# Altium project parero_DSP_board.PrjPcb
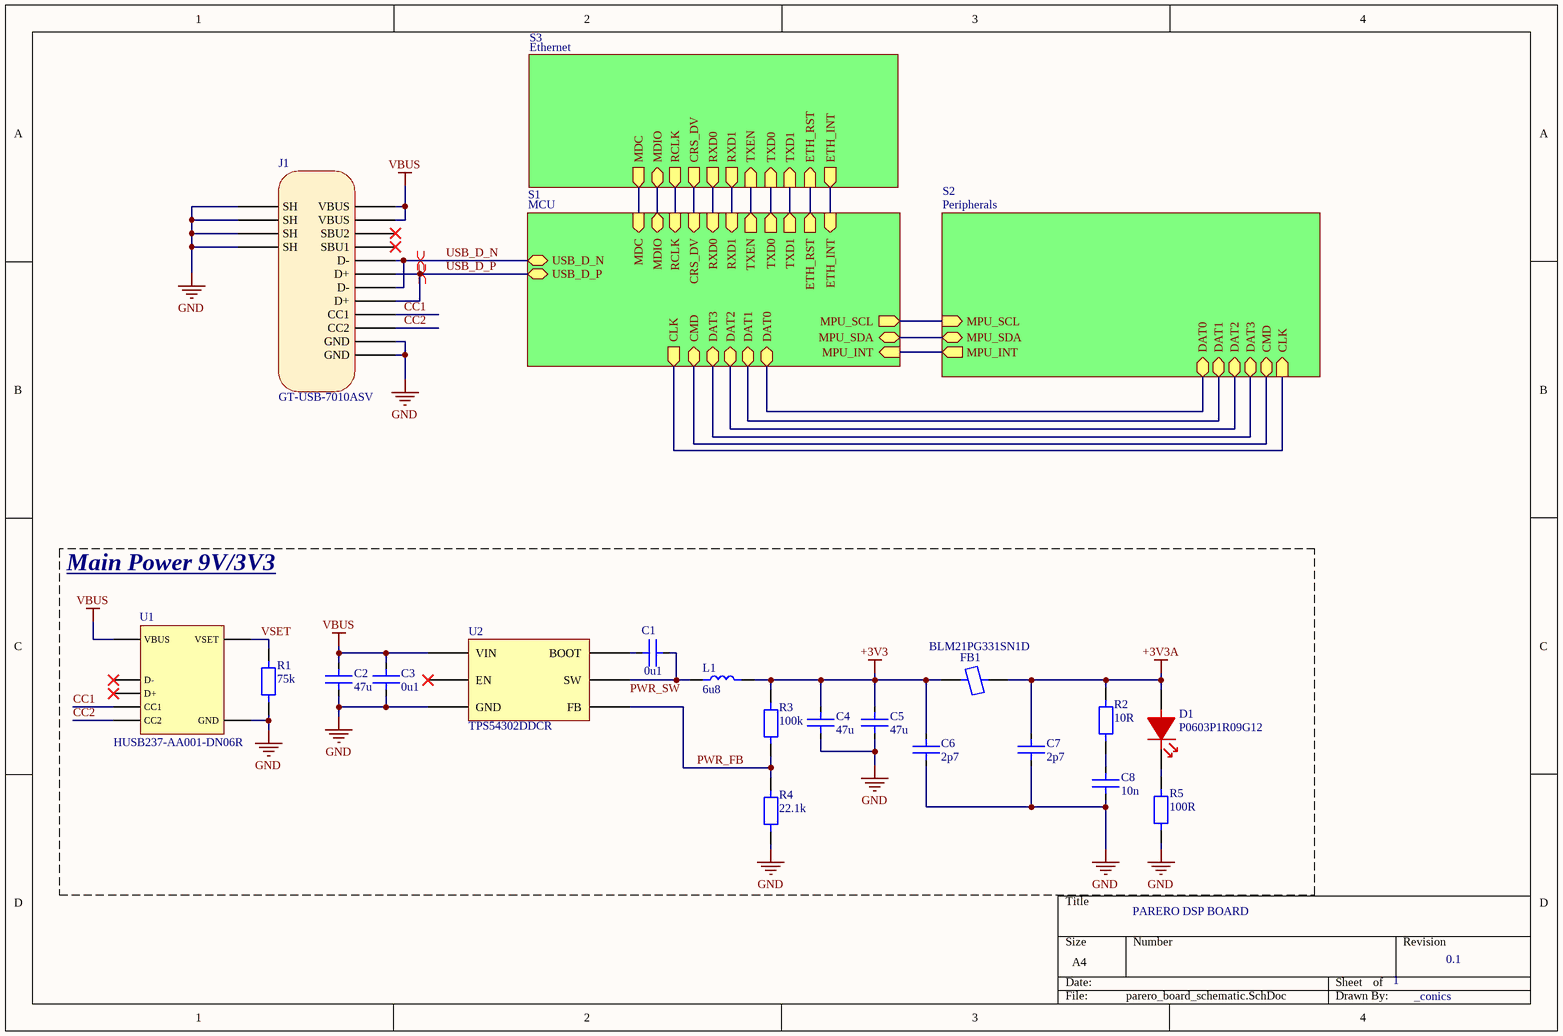
[diagram p0: parero_board_schematic.SchDoc]
4 sheets, 121 parts. Net scope: hierarchical (ports join the sheet entries above them; power ports are global).
Board file: parero_DSP_board.PcbDoc
Sheets:
  parero_board_schematic.SchDoc
    S1 = MCU.SchDoc
    S2 = Peripherals.SchDoc
    S3 = Ethernet.SchDoc

## Sheet parero_board_schematic.SchDoc: PARERO DSP BOARD
size A4; ApprovedBy: _conics; CheckedBy: Abdulrahman SJ; CompanyName: PARERO; DrawnBy: Abdulrahman; DocumentNumber: 1; Revision: 0.1; SheetNumber: 1; SheetTotal: 4

### Parts
C1  0u1  [CAP_MLCC_0402]
C2  47u  [CAP_MLCC_1210]
C3  0u1  [CAP_MLCC_0603]
C4  47u  [CAP_MLCC_1210]
C5  47u  [CAP_MLCC_1210]
C6  2p7  [CAP_MLCC_0402]
C7  2p7  [CAP_MLCC_0402]
C8  10n  [CAP_MLCC_0402]
D1  P0603P1R09G12  [LED_0603]
FB1  BLM21PG331SN1D  [FBEAD_0805]
J1  GT-USB-7010ASV  [CONN_CH_USB_SMD_USB]
L1  6u8  [INDM5452X30N]
R1  75k  [RES_SMD_0402]
R2  10R  [RES_SMD_0402]
R3  100k  [RES_SMD_0402]
R4  22.1k  [RES_SMD_0402]
R5  100R  [RES_SMD_0402]
U1  HUSB237-AA001-DN06R  [USB_PD_DFN6]
U2  TPS54302DDCR  [SOT95P280X110-6N]

### Blocks framed on the sheet
Main Power 9V/3V3: C1-C8 D1 FB1 L1 R1-R5 U1 U2

### Sub-sheets
S1 = MCU: MPU_SDA (bidir), MPU_INT (in), MPU_SCL (out), DAT0 (bidir), DAT1 (bidir), DAT2 (bidir), DAT3 (bidir), CMD (bidir), CLK (out), USB_D_P (bidir), USB_D_N (bidir), MDC (in), RCLK (in), MDIO (bidir), CRS_DV (in), RXD0 (in), RXD1 (in), TXD0 (out), TXEN (out), TXD1 (out), ETH_INT (in), ETH_RST (out)
S2 = Peripherals: MPU_SCL (in), MPU_SDA (bidir), MPU_INT (out), CLK (in), CMD (bidir), DAT3 (bidir), DAT2 (bidir), DAT1 (bidir), DAT0 (bidir)
S3 = Ethernet: RXD0 (out), RXD1 (out), TXD0 (in), TXD1 (in), RCLK (out), ETH_INT (out), CRS_DV (out), TXEN (in), MDC (out), MDIO (bidir), ETH_RST (in)

### Nets
+3V3: C4.2 C5.2 C6.2 FB1.2 L1.2 R3.2
+3V3A: C7.2 D1.2 FB1.1 R2.2
GND: C2.1 C3.1 C4.1 C5.1 C6.1 C7.1 C8.1 J1.11(GND) J1.12(GND) J1.13(SH) J1.14(SH) J1.15(SH) J1.16(SH) R1.2 R4.1 R5.1 U1.7(GND) U2.1(GND)
VBUS: C2.2 C3.2 J1.1(VBUS) J1.2(VBUS) U1.2(VBUS) U2.3(VIN)
CC1: J1.4(CC1) U1.1(CC1)
CC2: J1.10(CC2) U1.6(CC2)
CLK: sheet S1/CLK, sheet S2/CLK
CMD: sheet S1/CMD, sheet S2/CMD
CRS_DV: sheet S1/CRS_DV, sheet S3/CRS_DV
DAT0: sheet S1/DAT0, sheet S2/DAT0
DAT1: sheet S1/DAT1, sheet S2/DAT1
DAT2: sheet S1/DAT2, sheet S2/DAT2
DAT3: sheet S1/DAT3, sheet S2/DAT3
ETH_INT: sheet S1/ETH_INT, sheet S3/ETH_INT
ETH_RST: sheet S1/ETH_RST, sheet S3/ETH_RST
MDC: sheet S1/MDC, sheet S3/MDC
MDIO: sheet S1/MDIO, sheet S3/MDIO
MPU_SCL: sheet S1/MPU_SCL, sheet S2/MPU_SCL
MPU_SDA: sheet S1/MPU_SDA, sheet S2/MPU_SDA
PWR_FB: R3.1 R4.2 U2.4(FB)
PWR_SW: C1.1 L1.1 U2.2(SW)
RCLK: sheet S1/RCLK, sheet S3/RCLK
RXD0: sheet S1/RXD0, sheet S3/RXD0
RXD1: sheet S1/RXD1, sheet S3/RXD1
TXD0: sheet S1/TXD0, sheet S3/TXD0
TXD1: sheet S1/TXD1, sheet S3/TXD1
TXEN: sheet S1/TXEN, sheet S3/TXEN
USB_D_N: J1.5(D-) J1.7(D-) ; sheet S1/USB_D_N
USB_D_P: J1.6(D+) J1.8(D+) ; sheet S1/USB_D_P
VSET: R1.1 U1.3(VSET)
NetC1_2: C1.2 U2.6(BOOT)
NetC8_2: C8.2 R2.1
NetD1_1: D1.1 R5.2
NetR13_1: sheet S1/MPU_INT, sheet S2/MPU_INT

Not connected (* = marked no-connect by the designer): J1 3(SBU2)* 9(SBU1)*; U1 4(D+)* 5(D-)*; U2 5(EN)*

### Layout directives
differential pair: USB_D_N, USB_D_P

### Library data of the parts
C1 = Cap MLCC 0402: Multilayer  Ceramic Capacitor; Manufacturer 1: Samsung Electro-Mechanics; Manufacturer Part Number 1: CL05B104KO5NNNC; Designator: C?; Quantity: *
C2 C4 C5 = Cap MLCC 1210: Multilayer  Ceramic Capacitor; Manufacturer 1: muRata; Manufacturer Part Number 1: GRM32EC81C476KE15L; Designator: C?; Quantity: *
C3 = Cap MLCC 0603: Multilayer  Ceramic Capacitor; Manufacturer 1: Samsung Electro-Mechanics; Manufacturer Part Number 1: CL10B104JB8NNNC; Designator: C?; Quantity: *
C6 C7 = Cap MLCC 0402: Multilayer  Ceramic Capacitor; Manufacturer 1: muRata; Manufacturer Part Number 1: GRM1555C1H2R7CA01D; Designator: C?; Quantity: *
C8 = Cap MLCC 0402: Multilayer  Ceramic Capacitor; Manufacturer 1: muRata; Manufacturer Part Number 1: GRM1555C1E103GE01D; Designator: C?; Quantity: *
D1 = Diode LED R: 20mA 350mcd 621nm Red 2V 0603 LED Indication - Discrete ROHS; Manufacturer 1: Silverlight; Designator: D?; Manufacturer Part Number 1: P0603P1R09G12; Quantity: *; ComponentLink1Description: Product Link; ComponentLink1URL: https://www.lcsc.com/product-detail/C5123549.html; ComponentLink2Description: Datasheet; ComponentLink2URL: https://www.lcsc.com/datasheet/C5123549.pdf
FB1 = Filter Ferrite Bead 0805: 70mΩ ±25% 330Ω@100MHz 0805 Ferrite Beads and Chips RoHS; Manufacturer 1: muRata; Designator: FB?; Manufacturer Part Number 1: BLM21PG331SN1D; Quantity: *
J1 = Connector USB-C CH: USB 2.0 1 16P -40℃~+85℃ Type-C SMD USB, DVI, HDMI Connector Assemblies ROHS; Manufacturer 1: G-Switch; Manufacturer Part Number 1: GT-USB-7010ASV; Quantity: *; ComponentLink1Description: Datasheet; ComponentLink1URL: https://atta.szlcsc.com/upload/public/pdf/source/20230327/DF227B64686AC8FA0AD1775797F2C3F1.pdf; ComponentLink2Description: Product Link; ComponentLink2URL: https://www.lcsc.com/product-detail/C2988369.html
L1 = Inductor 6u8 3A SMD 5.4X5.2mm: 6.8uH Molded Inductor 4A SMD,5.4x5.2mm Fixed Inductors RoHS; Manufacturer 1: cjiang; Manufacturer Part Number 1: FXL0530-6R8-M; Designator: L?; Quantity: *; ComponentLink1Description: Datasheet; ComponentLink1URL: https://www.lcsc.com/datasheet/C177249.pdf; ComponentLink2Description: Product Link; ComponentLink2URL: https://www.lcsc.com/product-detail/C177249.html
R1 = Resistor 0402: General Purpose SMD Carbon Resistor; Manufacturer 1: UNI-ROYAL; Manufacturer Part Number 1: 0402WGD7502TCE; Designator: R?; Quantity: *
R2 = Resistor 0402: General Purpose SMD Carbon Resistor; Manufacturer 1: UNI-ROYAL; Manufacturer Part Number 1: 0402WGF100JTCE; Designator: R?; Quantity: *
R3 = Resistor 0402: General Purpose SMD Carbon Resistor; Manufacturer 1: UNI-ROYAL; Manufacturer Part Number 1: 0402WGD1003TCE; Designator: R?; Quantity: *
R4 = Resistor 0402: General Purpose SMD Carbon Resistor; Manufacturer 1: UNI-ROYAL; Manufacturer Part Number 1: 0402WGD2212TCE; Designator: R?; Quantity: *
R5 = Resistor 0402: General Purpose SMD Carbon Resistor; Manufacturer 1: UNI-ROYAL; Manufacturer Part Number 1: 0402WGF1000TCE; Designator: R?; Quantity: *
U1 = PMIC USB-PD 20V/5A: Power Receiver Controller 100W DFN-6L-EP(2x2) Power Management - Specialized RoHS; Manufacturer 1: Hynetek; Manufacturer Part Number 1: HUSB237-AA001-DN06R; Quantity: *; ComponentLink1Description: Datasheet; ComponentLink1URL: https://www.lcsc.com/datasheet/C22373734.pdf; ComponentLink2Description: Product Link; ComponentLink2URL: https://www.lcsc.com/product-detail/C22373734.html
U2 = DC/DC Buck Adj 3A: 400kHz Buck Adjustable 1 TSOT-23-6 Voltage Regulators - DC DC Switching Regulators RoHS; Manufacturer 1: TI; Manufacturer Part Number 1: TPS54302DDCR; Quantity: *; ComponentLink1Description: Datasheet; ComponentLink1URL: https://www.lcsc.com/datasheet/C311983.pdf; ComponentLink2Description: Product Link; ComponentLink2URL: https://www.lcsc.com/product-detail/C311983.html

## Sheet MCU.SchDoc
size 566 x 398 mm; SheetNumber: 2; SheetTotal: 4
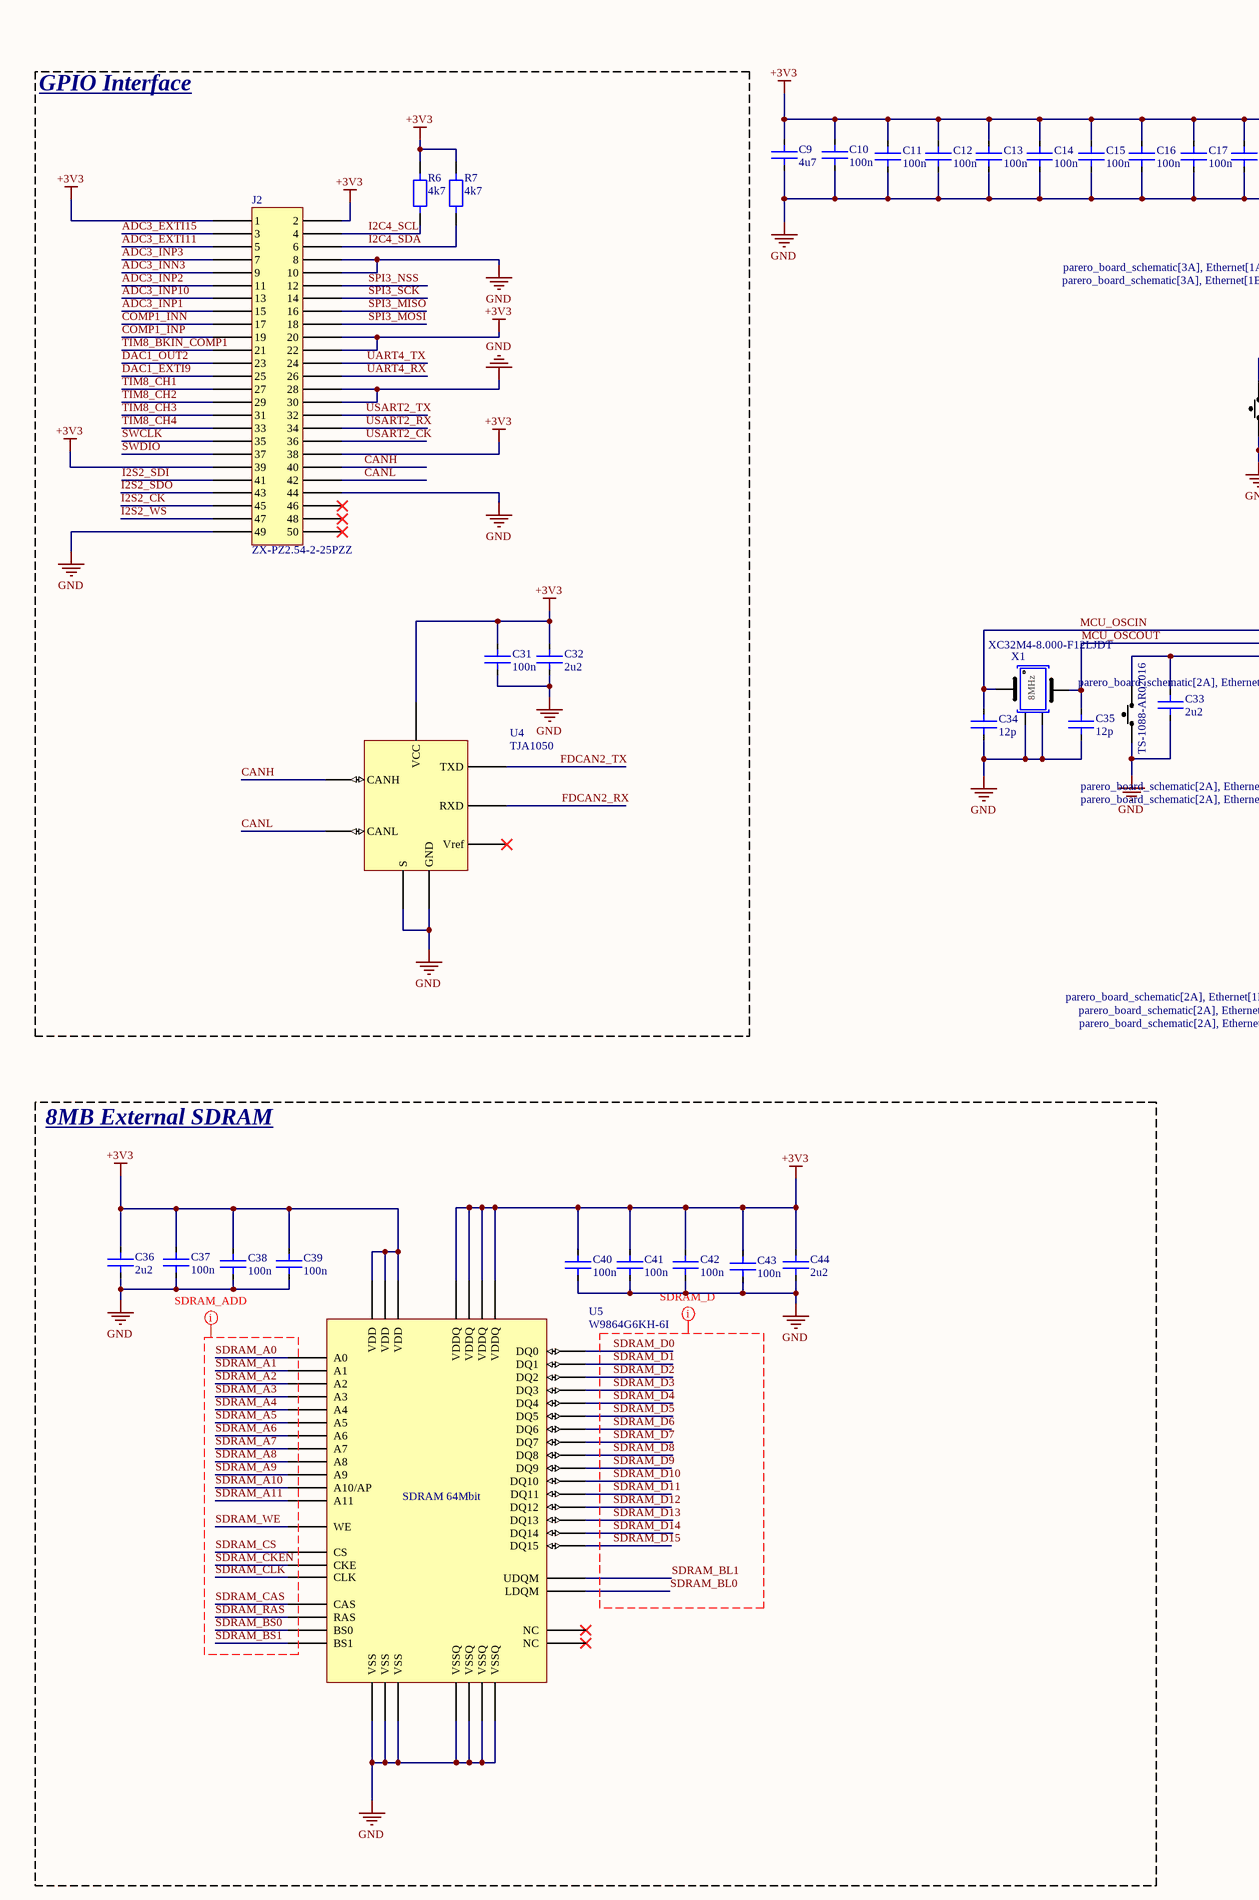
[diagram p1: MCU.SchDoc, left]
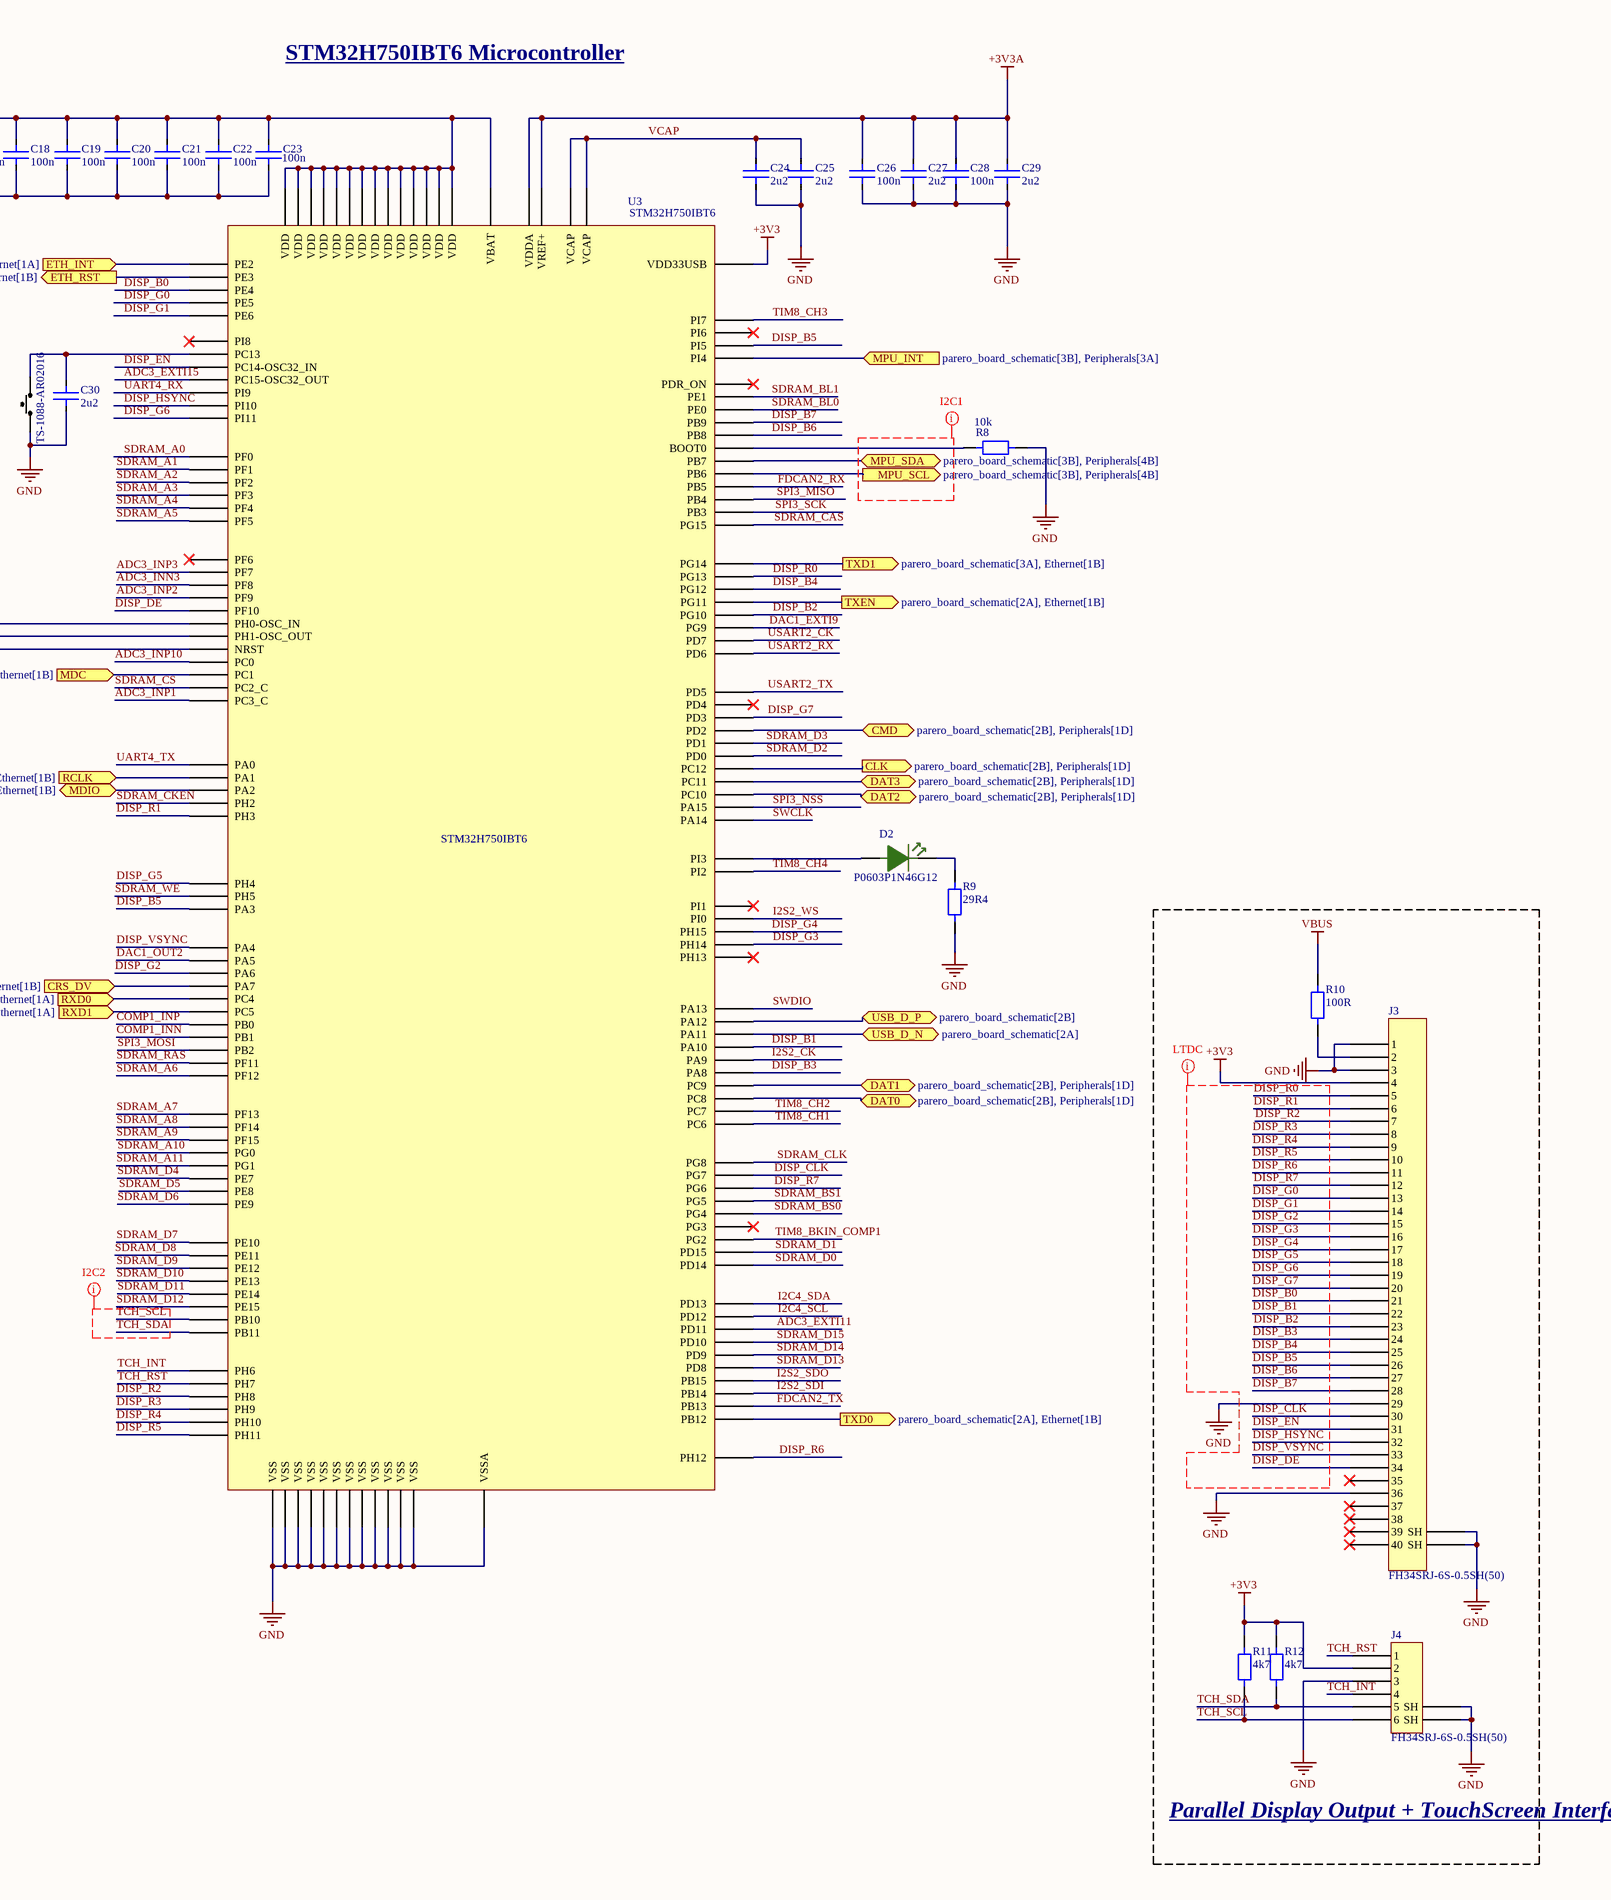
[diagram p2: MCU.SchDoc, right]

### Parts
C9  4u7  [CAP_MLCC_0603]
C10  100n  [CAP_MLCC_0402]
C11  100n  [CAP_MLCC_0402]
C12  100n  [CAP_MLCC_0402]
C13  100n  [CAP_MLCC_0402]
C14  100n  [CAP_MLCC_0402]
C15  100n  [CAP_MLCC_0402]
C16  100n  [CAP_MLCC_0402]
C17  100n  [CAP_MLCC_0402]
C18  100n  [CAP_MLCC_0402]
C19  100n  [CAP_MLCC_0402]
C20  100n  [CAP_MLCC_0402]
C21  100n  [CAP_MLCC_0402]
C22  100n  [CAP_MLCC_0402]
C23  100n  [CAP_MLCC_0402]
C24  2u2  [CAP_MLCC_0402]
C25  2u2  [CAP_MLCC_0402]
C26  100n  [CAP_MLCC_0402]
C27  2u2  [CAP_MLCC_0402]
C28  100n  [CAP_MLCC_0402]
C29  2u2  [CAP_MLCC_0402]
C30  2u2  [CAP_MLCC_0402]
C31  100n  [CAP_MLCC_0402]
C32  2u2  [CAP_MLCC_0603]
C33  2u2  [CAP_MLCC_0402]
C34  12p  [CAP_MLCC_0402]
C35  12p  [CAP_MLCC_0402]
C36  2u2  [CAP_MLCC_0603]
C37  100n  [CAP_MLCC_0402]
C38  100n  [CAP_MLCC_0402]
C39  100n  [CAP_MLCC_0402]
C40  100n  [CAP_MLCC_0402]
C41  100n  [CAP_MLCC_0402]
C42  100n  [CAP_MLCC_0402]
C43  100n  [CAP_MLCC_0402]
C44  2u2  [CAP_MLCC_0603]
D2  P0603P1N46G12  [LED_0603]
J2  ZX-PZ2.54-2-25PZZ  [PIN_HEADER_2X25P]
J3  FH34SRJ-6S-0.5SH(50)  [CONN_CH_SMD_FPC_40P]
J4  FH34SRJ-6S-0.5SH(50)  [CONN_CH_SMD_FPS_6P]
R6  4k7  [RES_SMD_0402]
R7  4k7  [RES_SMD_0402]
R8  10k  [RES_SMD_0402]
R9  29R4  [RES_SMD_0603]
R10  100R  [RES_SMD_0402]
R11  4k7  [RES_SMD_0402]
R12  4k7  [RES_SMD_0402]
SW1  TS-1088-AR02016  [SW_SMD_SPST]
SW2  TS-1088-AR02016  [SW_SMD_SPST]
U3  STM32H750IBT6  [STM32H750IBT6_176QFP]
U4  TJA1050  [TJA1050]
U5  W9864G6KH-6I  [W9864G6KH-6I-TSOP54]
X1  XC32M4-8.000-F12LJDT  [XTAL_SMD_HCL]

### Blocks framed on the sheet
GPIO Interface: C31 C32 J2 R6 R7 U4
Parallel Display Output + TouchScreen Interface: J3 J4 R10-R12
8MB External SDRAM: C36-C44 U5

### Ports
CLK (out, see parero_board_schematic[2B], Peripherals[1D]), CMD (bidir, see parero_board_schematic[2B], Peripherals[1D]), CRS_DV (in, see parero_board_schematic[2A], Ethernet[1B]), DAT0 (bidir, see parero_board_schematic[2B], Peripherals[1D]), DAT1 (bidir, see parero_board_schematic[2B], Peripherals[1D]), DAT2 (bidir, see parero_board_schematic[2B], Peripherals[1D]), DAT3 (bidir, see parero_board_schematic[2B], Peripherals[1D]), ETH_INT (in, see parero_board_schematic[3A], Ethernet[1A]), ETH_RST (out, see parero_board_schematic[3A], Ethernet[1B]), MDC (in, see parero_board_schematic[2A], Ethernet[1B]), MDIO (bidir, see parero_board_schematic[2A], Ethernet[1B]), MPU_INT (in, see parero_board_schematic[3B], Peripherals[3A]), MPU_SCL (out, see parero_board_schematic[3B], Peripherals[4B]), MPU_SDA (bidir, see parero_board_schematic[3B], Peripherals[4B]), RCLK (in, see parero_board_schematic[2A], Ethernet[1B]), RXD0 (in, see parero_board_schematic[2A], Ethernet[1A]), RXD1 (in, see parero_board_schematic[2A], Ethernet[1A]), TXD0 (out, see parero_board_schematic[2A], Ethernet[1B]), TXD1 (out, see parero_board_schematic[3A], Ethernet[1B]), TXEN (out, see parero_board_schematic[2A], Ethernet[1B]), USB_D_N (bidir, see parero_board_schematic[2A]), USB_D_P (bidir, see parero_board_schematic[2B])

### Nets
+3V3: C9.2 C10.2 C11.2 C12.2 C13.2 C14.2 C15.2 C16.2 C17.2 C18.2 C19.2 C20.2 C21.2 C22.2 C23.2 C31.2 C32.2 C36.2 C37.2 C38.2 C39.2 C40.2 C41.2 C42.2 C43.2 C44.2 J2.1 J2.2 J2.20 J2.22 J2.38 J2.39 J3.4 J4.2 R6.2 R7.2 R11.2 R12.2 U3.6(VBAT) U3.15(VDD) U3.23(VDD) U3.36(VDD) U3.49(VDD) U3.62(VDD) U3.72(VDD) U3.82(VDD) U3.91(VDD) U3.103(VDD) U3.114(VDD33USB) U3.127(VDD) U3.136(VDD) U3.149(VDD) U3.159(VDD) U3.172(VDD) U4.3(VCC) U5.1(VDD) U5.3(VDDQ) U5.9(VDDQ) U5.14(VDD) U5.27(VDD) U5.43(VDDQ) U5.49(VDDQ)
+3V3A: C26.2 C27.2 C28.2 C29.2 U3.38(VREF+) U3.39(VDDA)
GND: C9.1 C10.1 C11.1 C12.1 C13.1 C14.1 C15.1 C16.1 C17.1 C18.1 C19.1 C20.1 C21.1 C22.1 C23.1 C24.1 C25.1 C26.1 C27.1 C28.1 C29.1 C30.1 C31.1 C32.1 C33.1 C34.1 C35.1 C36.1 C37.1 C38.1 C39.1 C40.1 C41.1 C42.1 C43.1 C44.1 J2.8 J2.10 J2.28 J2.30 J2.44 J2.49 J3.1 J3.3 J3.29 J3.36 J3.41(SH) J3.42(SH) J4.3 J4.7(SH) J4.8(SH) R8.2 R9.1 SW1.1 SW2.1 U3.14(VSS) U3.22(VSS) U3.37(VSSA) U3.48(VSS) U3.61(VSS) U3.71(VSS) U3.90(VSS) U3.102(VSS) U3.113(VSS) U3.126(VSS) U3.135(VSS) U3.148(VSS) U3.158(VSS) U4.2(GND) U4.8(S) U5.6(VSSQ) U5.12(VSSQ) U5.28(VSS) U5.41(VSS) U5.46(VSSQ) U5.52(VSSQ) U5.54(VSS) X1.2 X1.4
VBUS: R10.2
ADC3_EXTI11: J2.5 U3.99(PD11)
ADC3_EXTI15: J2.3 U3.10(PC15-OSC32_OUT)
ADC3_INN3: J2.9 U3.26(PF8)
ADC3_INP1: J2.15 U3.35(PC3_C)
ADC3_INP2: J2.11 U3.27(PF9)
ADC3_INP3: J2.7 U3.25(PF7)
ADC3_INP10: J2.13 U3.32(PC0)
CANH: J2.40 U4.7(CANH)
CANL: J2.42 U4.6(CANL)
CLK: U3.141(PC12) ; port CLK
CMD: U3.144(PD2) ; port CMD
COMP1_INN: J2.17 U3.57(PB1)
COMP1_INP: J2.19 U3.56(PB0)
CRS_DV: U3.53(PA7) ; port CRS_DV
DAC1_EXTI9: J2.25 U3.152(PG9)
DAC1_OUT2: J2.23 U3.51(PA5)
DAT0: U3.117(PC8) ; port DAT0
DAT1: U3.118(PC9) ; port DAT1
DAT2: U3.139(PC10) ; port DAT2
DAT3: U3.140(PC11) ; port DAT3
DISP_B0: J3.21 U3.3(PE4)
DISP_B1: J3.22 U3.121(PA10)
DISP_B2: J3.23 U3.153(PG10)
DISP_B3: J3.24 U3.119(PA8)
DISP_B4: J3.25 U3.155(PG12)
DISP_B5: J3.26 U3.47(PA3) U3.174(PI5)
DISP_B6: J3.27 U3.167(PB8)
DISP_B7: J3.28 U3.168(PB9)
DISP_CLK: J3.30 U3.111(PG7)
DISP_DE: J3.34 U3.28(PF10)
DISP_EN: J3.31 U3.9(PC14-OSC32_IN)
DISP_G0: J3.13 U3.4(PE5)
DISP_G1: J3.14 U3.5(PE6)
DISP_G2: J3.15 U3.52(PA6)
DISP_G3: J3.16 U3.129(PH14)
DISP_G4: J3.17 U3.130(PH15)
DISP_G5: J3.18 U3.45(PH4)
DISP_G6: J3.19 U3.13(PI11)
DISP_G7: J3.20 U3.145(PD3)
DISP_HSYNC: J3.32 U3.12(PI10)
DISP_R0: J3.5 U3.156(PG13)
DISP_R1: J3.6 U3.44(PH3)
DISP_R2: J3.7 U3.85(PH8)
DISP_R3: J3.8 U3.86(PH9)
DISP_R4: J3.9 U3.87(PH10)
DISP_R5: J3.10 U3.88(PH11)
DISP_R6: J3.11 U3.89(PH12)
DISP_R7: J3.12 U3.110(PG6)
DISP_VSYNC: J3.33 U3.50(PA4)
ETH_INT: U3.1(PE2) ; port ETH_INT
ETH_RST: U3.2(PE3) ; port ETH_RST
FDCAN2_RX: U3.163(PB5) U4.4(RXD)
FDCAN2_TX: U3.93(PB13) U4.1(TXD)
I2C4_SCL: J2.4 R6.1 U3.100(PD12)
I2C4_SDA: J2.6 R7.1 U3.101(PD13)
I2S2_CK: J2.45 U3.120(PA9)
I2S2_SDI: J2.41 U3.94(PB14)
I2S2_SDO: J2.43 U3.95(PB15)
I2S2_WS: J2.47 U3.131(PI0)
MCU_OSCIN: C34.2 U3.29(PH0-OSC_IN) X1.1
MCU_OSCOUT: C35.2 U3.30(PH1-OSC_OUT) X1.3
MDC: U3.33(PC1) ; port MDC
MDIO: U3.42(PA2) ; port MDIO
MPU_SCL: U3.164(PB6) ; port MPU_SCL
MPU_SDA: U3.165(PB7) ; port MPU_SDA
RCLK: U3.41(PA1) ; port RCLK
RXD0: U3.54(PC4) ; port RXD0
RXD1: U3.55(PC5) ; port RXD1
SDRAM_A0: U3.16(PF0) U5.23(A0)
SDRAM_A1: U3.17(PF1) U5.24(A1)
SDRAM_A2: U3.18(PF2) U5.25(A2)
SDRAM_A3: U3.19(PF3) U5.26(A3)
SDRAM_A4: U3.20(PF4) U5.29(A4)
SDRAM_A5: U3.21(PF5) U5.30(A5)
SDRAM_A6: U3.60(PF12) U5.31(A6)
SDRAM_A7: U3.63(PF13) U5.32(A7)
SDRAM_A8: U3.64(PF14) U5.33(A8)
SDRAM_A9: U3.65(PF15) U5.34(A9)
SDRAM_A10: U3.66(PG0) U5.22(A10/AP)
SDRAM_A11: U3.67(PG1) U5.35(A11)
SDRAM_BL0: U3.169(PE0) U5.15(LDQM)
SDRAM_BL1: U3.170(PE1) U5.39(UDQM)
SDRAM_BS0: U3.108(PG4) U5.20(BS0)
SDRAM_BS1: U3.109(PG5) U5.21(BS1)
SDRAM_CAS: U3.160(PG15) U5.17(CAS)
SDRAM_CKEN: U3.43(PH2) U5.37(CKE)
SDRAM_CLK: U3.112(PG8) U5.38(CLK)
SDRAM_CS: U3.34(PC2_C) U5.19(CS)
SDRAM_D0: U3.104(PD14) U5.2(DQ0)
SDRAM_D1: U3.105(PD15) U5.4(DQ1)
SDRAM_D2: U3.142(PD0) U5.5(DQ2)
SDRAM_D3: U3.143(PD1) U5.7(DQ3)
SDRAM_D4: U3.68(PE7) U5.8(DQ4)
SDRAM_D5: U3.69(PE8) U5.10(DQ5)
SDRAM_D6: U3.70(PE9) U5.11(DQ6)
SDRAM_D7: U3.73(PE10) U5.13(DQ7)
SDRAM_D8: U3.74(PE11) U5.42(DQ8)
SDRAM_D9: U3.75(PE12) U5.44(DQ9)
SDRAM_D10: U3.76(PE13) U5.45(DQ10)
SDRAM_D11: U3.77(PE14) U5.47(DQ11)
SDRAM_D12: U3.78(PE15) U5.48(DQ12)
SDRAM_D13: U3.96(PD8) U5.50(DQ13)
SDRAM_D14: U3.97(PD9) U5.51(DQ14)
SDRAM_D15: U3.98(PD10) U5.53(DQ15)
SDRAM_RAS: U3.59(PF11) U5.18(RAS)
SDRAM_WE: U3.46(PH5) U5.16(WE)
SPI3_MISO: J2.16 U3.162(PB4)
SPI3_MOSI: J2.18 U3.58(PB2)
SPI3_NSS: J2.12 U3.138(PA15)
SPI3_SCK: J2.14 U3.161(PB3)
SWCLK: J2.35 U3.137(PA14)
SWDIO: J2.37 U3.124(PA13)
TCH_INT: J4.4 U3.83(PH6)
TCH_RST: J4.1 U3.84(PH7)
TCH_SCL: J4.6 R11.1 U3.79(PB10)
TCH_SDA: J4.5 R12.1 U3.80(PB11)
TIM8_BKIN_COMP1: J2.21 U3.106(PG2)
TIM8_CH1: J2.27 U3.115(PC6)
TIM8_CH2: J2.29 U3.116(PC7)
TIM8_CH3: J2.31 U3.176(PI7)
TIM8_CH4: J2.33 U3.133(PI2)
TXD0: U3.92(PB12) ; port TXD0
TXD1: U3.157(PG14) ; port TXD1
TXEN: U3.154(PG11) ; port TXEN
UART4_RX: J2.26 U3.11(PI9)
UART4_TX: J2.24 U3.40(PA0)
USART2_CK: J2.36 U3.151(PD7)
USART2_RX: J2.34 U3.150(PD6)
USART2_TX: J2.32 U3.147(PD5)
USB_D_N: U3.122(PA11) ; port USB_D_N
USB_D_P: U3.123(PA12) ; port USB_D_P
VCAP: C24.2 C25.2 U3.81(VCAP) U3.125(VCAP)
NetC30_2: C30.2 SW1.2 U3.8(PC13)
NetC33_2: C33.2 SW2.2 U3.31(NRST)
NetD2_1: D2.1 R9.2
NetD2_2: D2.2 U3.134(PI3)
NetJ3_2: J3.2 R10.1
NetR8_1: R8.1 U3.166(BOOT0)
NetR13_1: U3.173(PI4) ; port MPU_INT

Not connected (* = marked no-connect by the designer): J2 46* 48* 50*; J3 35* 37* 38* 39* 40*; U3 7(PI8)* 24(PF6)* 107(PG3)* 128(PH13)* 132(PI1)* 146(PD4)* 171(PDR_ON)* 175(PI6)*; U4 5(Vref)*; U5 36(NC)* 40(NC)*

### Layout directives
net class SDRAM_DGRP: SDRAM_BL0, SDRAM_BL1, SDRAM_D0, SDRAM_D1, SDRAM_D2, SDRAM_D3, SDRAM_D4, SDRAM_D5, SDRAM_D6, SDRAM_D7, SDRAM_D8, SDRAM_D9, SDRAM_D10, SDRAM_D11, SDRAM_D12, SDRAM_D13, SDRAM_D14, SDRAM_D15
net class LTDC: DISP_B0, DISP_B1, DISP_B2, DISP_B3, DISP_B4, DISP_B5, DISP_B6, DISP_B7, DISP_CLK, DISP_DE, DISP_EN, DISP_G0, DISP_G1, DISP_G2, DISP_G3, DISP_G4, DISP_G5, DISP_G6, DISP_G7, DISP_HSYNC, DISP_R0, DISP_R1, DISP_R2, DISP_R3, DISP_R4, DISP_R5, DISP_R6, DISP_R7, DISP_VSYNC
mark named I2C1: (no net found under the mark)
mark named I2C2: TCH_SCL, TCH_SDA
net class SDRAM_AGRP: SDRAM_A0, SDRAM_A1, SDRAM_A2, SDRAM_A3, SDRAM_A4, SDRAM_A5, SDRAM_A6, SDRAM_A7, SDRAM_A8, SDRAM_A9, SDRAM_A10, SDRAM_A11, SDRAM_BS0, SDRAM_BS1, SDRAM_CAS, SDRAM_CKEN, SDRAM_CLK, SDRAM_CS, SDRAM_RAS, SDRAM_WE

### Notes on the sheet
- STM32H750IBT6 Microcontroller
- (in symbol Crystal SMD 8MHz) 8MHz
- (in symbol Memory SDRAM W9864G6KH-6I) SDRAM 64Mbit

### Library data of the parts
C9 = Cap MLCC 0603: Multilayer  Ceramic Capacitor; Manufacturer 1: muRata; Manufacturer Part Number 1: GRM188R60J475KE19D; Designator: C?; Quantity: *
C10-C23 C31 C37-C43 = Cap MLCC 0402: as C1 on sheet parero_board_schematic; Quantity: *
  C10-C18 C20-C23: Parameter 1: *
C24 C25 C27 C29 C30 C33 = Cap MLCC 0402: Multilayer  Ceramic Capacitor; Manufacturer 1: muRata; Manufacturer Part Number 1: GRM155R61A225KE95D; Designator: C?; Quantity: *
C26 C28 = Cap MLCC 0402: Multilayer  Ceramic Capacitor; Designator: C?; Manufacturer 1: *; Manufacturer Part Number 1: *; Quantity: *; Parameter 1: *
C32 C36 C44 = Cap MLCC 0603: Multilayer  Ceramic Capacitor; Manufacturer 1: Samsung Electro-Mechanics; Manufacturer Part Number 1: CL10A225KA8NNNC; Designator: C?; Quantity: *
C34 C35 = Cap MLCC 0402: Multilayer  Ceramic Capacitor; Manufacturer 1: muRata; Manufacturer Part Number 1: GRM1555C1H120GA01D; Designator: C?; Quantity: *
D2 = Diode LED G: 1200mcd 518nm~524nm Green 3V 0603 LED Indication - Discrete ROHS; Manufacturer 1: Silverlight; Manufacturer Part Number 1: P0603P1N46G12; Quantity: *; ComponentLink1Description: Datasheet; ComponentLink1URL: https://www.lcsc.com/datasheet/C5123548.pdf; ComponentLink2Description: Product Link; ComponentLink2URL: https://www.lcsc.com/product-detail/C5123548.html
J2 = Pin Header 2X25 Pitch 2.54mm: 2x25P 50P Gold Brass -40℃~+105℃ Pin Header Black 2.54mm 2.5mm 6mm 1kV 3mm 3A 2 Through Hole 2.54mm Through Hole,P=2.54mm Headers, Male Pins RoHS; Manufacturer 1: Megastar; Designator: J?; Manufacturer Part Number 1: ZX-PZ2.54-2-25PZZ; Quantity: *; ComponentLink1Description: Product Link; ComponentLink1URL: https://www.lcsc.com/product-detail/C7501284.html; ComponentLink2Description: Datasheet; ComponentLink2URL: https://www.lcsc.com/datasheet/C7501284.pdf
J3 = Connector FFC_40PH CH: -55℃~+105℃ 6P 0.5mm Double-Sided Contacts, Top and Bottom Entry Surface Mount, Right Angle SMD,P=0.5mm,Surface Mount,Right Angle FFC, FPC (Flat Flexible) Connector Assemblies RoHS; Manufacturer 1: HRS; Designator: J?; Manufacturer Part Number 1: FH34SRJ-6S-0.5SH(50); Quantity: *; ComponentLink1Description: Product Link; ComponentLink1URL: https://www.lcsc.com/product-detail/C224194.html; ComponentLink2Description: Datasheet; ComponentLink2URL: https://item.szlcsc.com/datasheet/AFC01-S40FCA-00/253933.html?lcsc_vid=QlAKU11QQVEKAwJVFVlZAVZfFgcNAwFWR1JaBVRSFAAxVlNQRVZYU1xXRVhXVjsOAxUeFF5JWBEcCEoDFhIXAgAHWQIBCks%3D
J4 = Connector FFC_6PH CH: -55℃~+105℃ 6P 0.5mm Double-Sided Contacts, Top and Bottom Entry Surface Mount, Right Angle SMD,P=0.5mm,Surface Mount,Right Angle FFC, FPC (Flat Flexible) Connector Assemblies RoHS; Manufacturer 1: HRS; Designator: J?; Manufacturer Part Number 1: FH34SRJ-6S-0.5SH(50); Quantity: *; ComponentLink1Description: Product Link; ComponentLink1URL: https://www.lcsc.com/product-detail/C224194.html; ComponentLink2Description: Datasheet; ComponentLink2URL: https://www.lcsc.com/datasheet/C224194.pdf
R6 R7 R11 R12 = Resistor 0402: General Purpose SMD Carbon Resistor; Manufacturer 1: UNI-ROYAL; Manufacturer Part Number 1: 0402WGF4701TCE; Designator: R?; Quantity: *
R8 = Resistor 0402: General Purpose SMD Carbon Resistor; Manufacturer 1: UNI-ROYAL; Manufacturer Part Number 1: 0402WGF1002TCE; Designator: R?; Quantity: *
R9 = Resistor 0603: General Purpose SMD Carbon Resistor; Manufacturer 1: UNI-ROYAL; Manufacturer Part Number 1: 0603WAF294JT5E; Designator: R?; Quantity: *
R10 = Resistor 0402: as R5 on sheet parero_board_schematic; Quantity: *
SW1 SW2 = Switch SMD SPST: Without Bracket 4mm 12V 3mm Round Button SPST 50mA SMD,4x3mm Tactile Switches ROHS; Manufacturer 1: XUNPU; Designator: SW?; Manufacturer Part Number 1: TS-1088-AR02016; Quantity: *; ComponentLink1Description: Datasheet; ComponentLink1URL: https://item.szlcsc.com/datasheet/TS-1088-AR02016/763484.html?lcsc_vid=T1EMVlBfE1BXVVADFQQNUlMFT1RXUAZeFlhfBlAAQVExVlNQR1lZUlJWR1BfVTsOAxUeFF5JWBEcCEoDFhIXAgAHWQIBCks%3D; ComponentLink2Description: Product Link; ComponentLink2URL: https://www.lcsc.com/product-detail/C720477.html
U3 = MCU STM32H750IBT6: ARM Cortex-M Series 480MHz 140 LQFP-176(24x24) Microcontrollers RoHS; Manufacturer 1: ST; Designator: U?; Manufacturer Part Number 1: ARM Cortex-M Series 480MHz 140 LQFP-176(24x24) Microcontrollers RoHS; Quantity: *; ComponentLink1Description: Product Link; ComponentLink1URL: https://www.lcsc.com/product-detail/C730201.html; ComponentLink2Description: Datasheet; ComponentLink2URL: https://www.lcsc.com/datasheet/C730201.pdf
U4 = Interface CAN Transceiver TJA1050: 1Mbps 4.75V~5.25V 50mA CAN Transceiver SOP-8 CAN Transceivers ROHS; Manufacturer Part Number 1: TJA1050T/CM,118; Manufacturer 1: NXP Semicon; Designator: U?; Quantity: *; ComponentLink1Description: Product Link; ComponentLink1URL: *; ComponentLink2Description: Datasheet; ComponentLink2URL: https://www.nxp.com/docs/en/data-sheet/TJA1050.pdf
U5 = Memory SDRAM W9864G6KH-6I: 64Mbit 3V~3.6V 166MHz TSOP-54-10.2mm Memory (ICs) RoHS; Manufacturer 1: Winbond; Quantity: *; Manufacturer Part Number 1: W9864G6KH-6I; ComponentLink1Description: Datasheet; ComponentLink1URL: https://www.lcsc.com/datasheet/C503937.pdf; ComponentLink2Description: Product Link; ComponentLink2URL: https://www.lcsc.com/product-detail/C503937.html
X1 = Crystal SMD 8MHz: Crystal Oscillator 12pF SMD3225-4P Crystals RoHS; Manufacturer 1: HCI; Designator: X?; Manufacturer Part Number 1: XC32M4-8.000-F12LJDT; Quantity: *; ComponentLink1Description: Datasheet; ComponentLink1URL: https://www.lcsc.com/datasheet/C2842191.pdf; ComponentLink2Description: Product Link; ComponentLink2URL: https://www.lcsc.com/datasheet/C2842191.pdf

## Sheet Peripherals.SchDoc
size A4; SheetNumber: 3; SheetTotal: 4
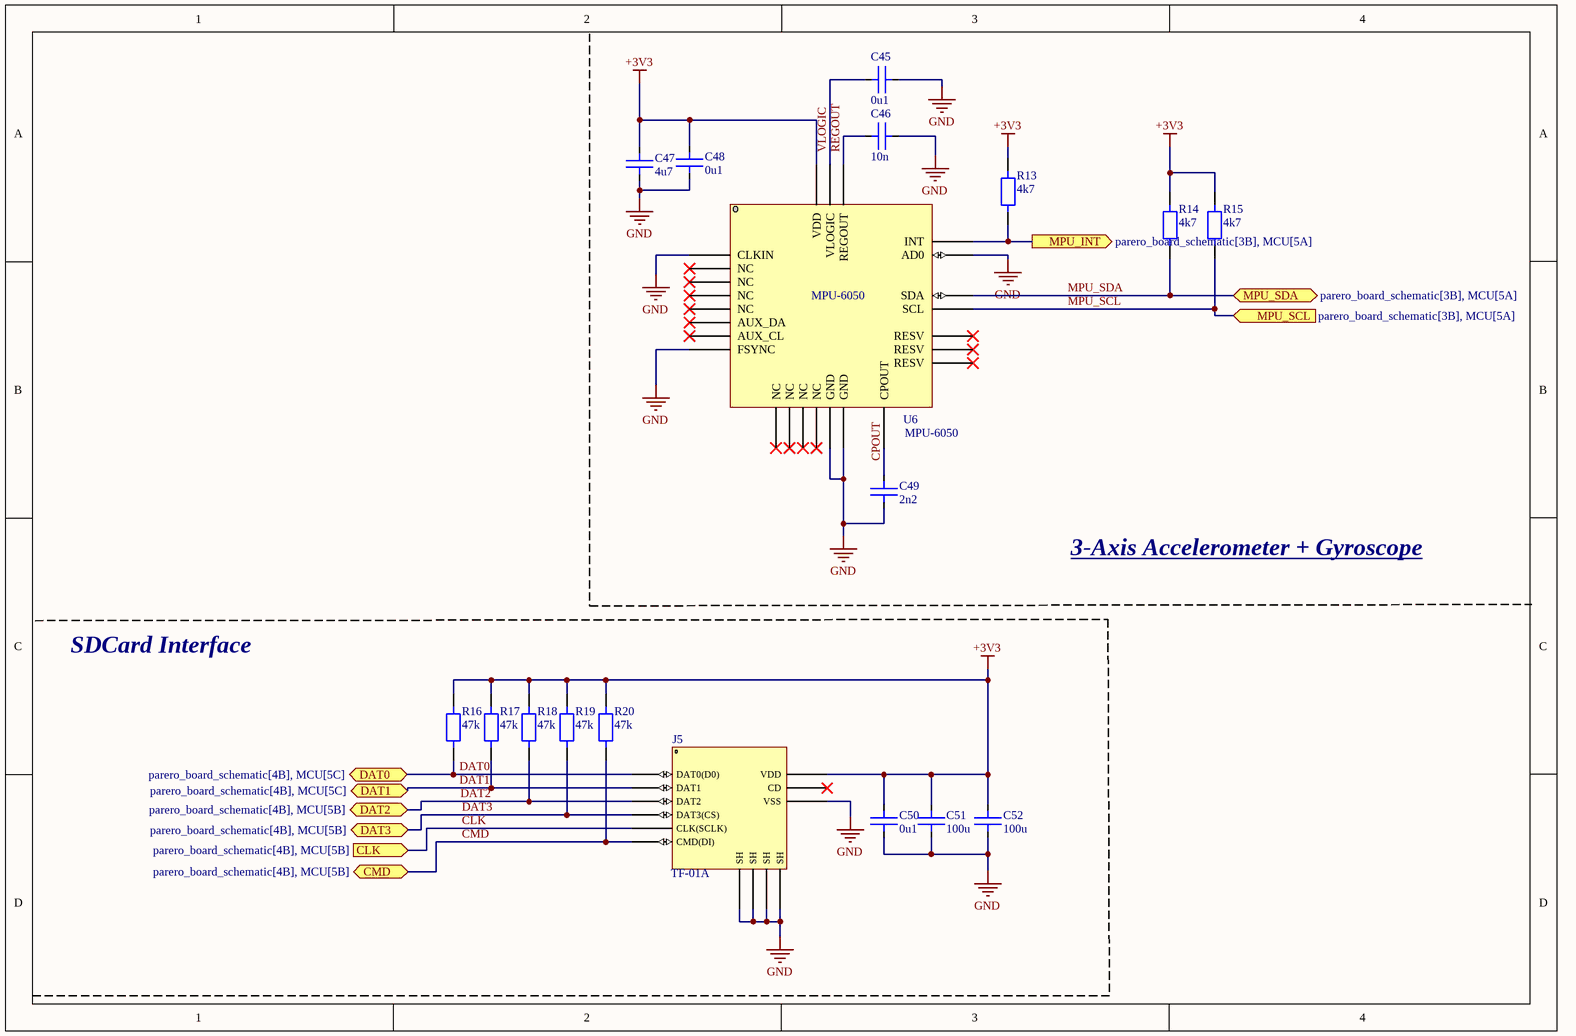
[diagram p3: Peripherals.SchDoc]

### Parts
C45  0u1  [CAP_MLCC_0402]
C46  10n  [CAP_MLCC_0402]
C47  4u7  [CAP_MLCC_0603]
C48  0u1  [CAP_MLCC_0402]
C49  2n2  [CAP_MLCC_0402]
C50  0u1  [CAP_MLCC_0402]
C51  100u  [CAP_MLCC_1206]
C52  100u  [CAP_MLCC_1206]
J5  TF-01A  [CONN_CH_SMD_SD_CARD]
R13  4k7  [RES_SMD_0402]
R14  4k7  [RES_SMD_0402]
R15  4k7  [RES_SMD_0402]
R16  47k  [RES_SMD_0402]
R17  47k  [RES_SMD_0402]
R18  47k  [RES_SMD_0402]
R19  47k  [RES_SMD_0402]
R20  47k  [RES_SMD_0402]
U6  MPU-6050  [MPU-6050]

### Ports
CLK (in, see parero_board_schematic[4B], MCU[5B]), CMD (bidir, see parero_board_schematic[4B], MCU[5B]), DAT0 (bidir, see parero_board_schematic[4B], MCU[5C]), DAT1 (bidir, see parero_board_schematic[4B], MCU[5C]), DAT2 (bidir, see parero_board_schematic[4B], MCU[5B]), DAT3 (bidir, see parero_board_schematic[4B], MCU[5B]), MPU_INT (out, see parero_board_schematic[3B], MCU[5A]), MPU_SCL (in, see parero_board_schematic[3B], MCU[5A]), MPU_SDA (bidir, see parero_board_schematic[3B], MCU[5A])

### Nets
+3V3: C47.2 C48.2 C50.2 C51.2 C52.2 J5.4(VDD) R13.2 R14.2 R15.2 R16.2 R17.2 R18.2 R19.2 R20.2 U6.13(VDD)
GND: C45.1 C46.1 C47.1 C48.1 C49.1 C50.1 C51.1 C52.1 J5.6(VSS) J5.10(SH) J5.11(SH) J5.12(SH) J5.13(SH) U6.1(CLKIN) U6.9(AD0) U6.11(FSYNC) U6.18(GND) U6.25(GND)
CLK: J5.5(CLK(SCLK)) ; port CLK
CMD: J5.3(CMD(DI)) R20.1 ; port CMD
CPOUT: C49.2 U6.20(CPOUT)
DAT0: J5.7(DAT0(D0)) R16.1 ; port DAT0
DAT1: J5.8(DAT1) R17.1 ; port DAT1
DAT2: J5.1(DAT2) R18.1 ; port DAT2
DAT3: J5.2(DAT3(CS)) R19.1 ; port DAT3
MPU_SCL: R15.1 U6.23(SCL) ; port MPU_SCL
MPU_SDA: R14.1 U6.24(SDA) ; port MPU_SDA
REGOUT: C46.2 U6.10(REGOUT)
VLOGIC: C45.2 U6.8(VLOGIC)
NetR13_1: R13.1 U6.12(INT) ; port MPU_INT

Not connected (* = marked no-connect by the designer): J5 9(CD)*; U6 2(NC)* 3(NC)* 4(NC)* 5(NC)* 6(AUX_DA)* 7(AUX_CL)* 14(NC)* 15(NC)* 16(NC)* 17(NC)* 19(RESV)* 21(RESV)* 22(RESV)*

### Notes on the sheet
- 3-Axis Accelerometer + Gyroscope
- SDCard Interface

### Library data of the parts
C45 C48 C50 = Cap MLCC 0402: as C1 on sheet parero_board_schematic; Quantity: *
C46 = Cap MLCC 0402: as C8 on sheet parero_board_schematic; Quantity: *
C47 = Cap MLCC 0603: as C9 on sheet MCU; Quantity: *
C49 = Cap MLCC 0402: Multilayer  Ceramic Capacitor; Manufacturer 1: muRata; Manufacturer Part Number 1: GRM1555C1H222GA01D; Designator: C?; Quantity: *
C51 C52 = Cap MLCC 1206: Multilayer  Ceramic Capacitor; Manufacturer 1: muRata; Manufacturer Part Number 1: GRM31CR60J107KEA8L; Designator: C?; Quantity: *
J5 = Connector SD Card CH: Push-Push 1.85mm Connector and Ejector MicroSD Card (TF Card) SMD PC Card Sockets ROHS; Manufacturer 1: Korean Hroparts Elec; Manufacturer Part Number 1: TF-01A; Quantity: *; ComponentLink1Description: Datasheet; ComponentLink1URL: https://www.lcsc.com/datasheet/C91145.pdf; ComponentLink2Description: Product Link; ComponentLink2URL: https://www.lcsc.com/product-detail/C91145.html
R13-R15 = Resistor 0402: General Purpose SMD Carbon Resistor; Manufacturer 1: UNI-ROYAL; Manufacturer Part Number 1: 0402WGF4701TCE; Quantity: *
R16-R20 = Resistor 0402: General Purpose SMD Carbon Resistor; Manufacturer 1: UNI-ROYAL; Manufacturer Part Number 1: 0402WGF4702TCE; Quantity: *
U6 = Sensor MPU-6050: Accelerometer Gyroscope I2C QFN-24-EP(4x4) Accelerometers ROHS; Manufacturer 1: TDK InvenSense; Designator: U?; Manufacturer Part Number 1: MPU-6050; Quantity: *; ComponentLink1Description: Datasheet; ComponentLink1URL: https://www.lcsc.com/datasheet/C24112.pdf; ComponentLink2Description: Product Link; ComponentLink2URL: https://www.lcsc.com/product-detail/C24112.html

## Sheet Ethernet.SchDoc
size A4; SheetNumber: 4; SheetTotal: 4
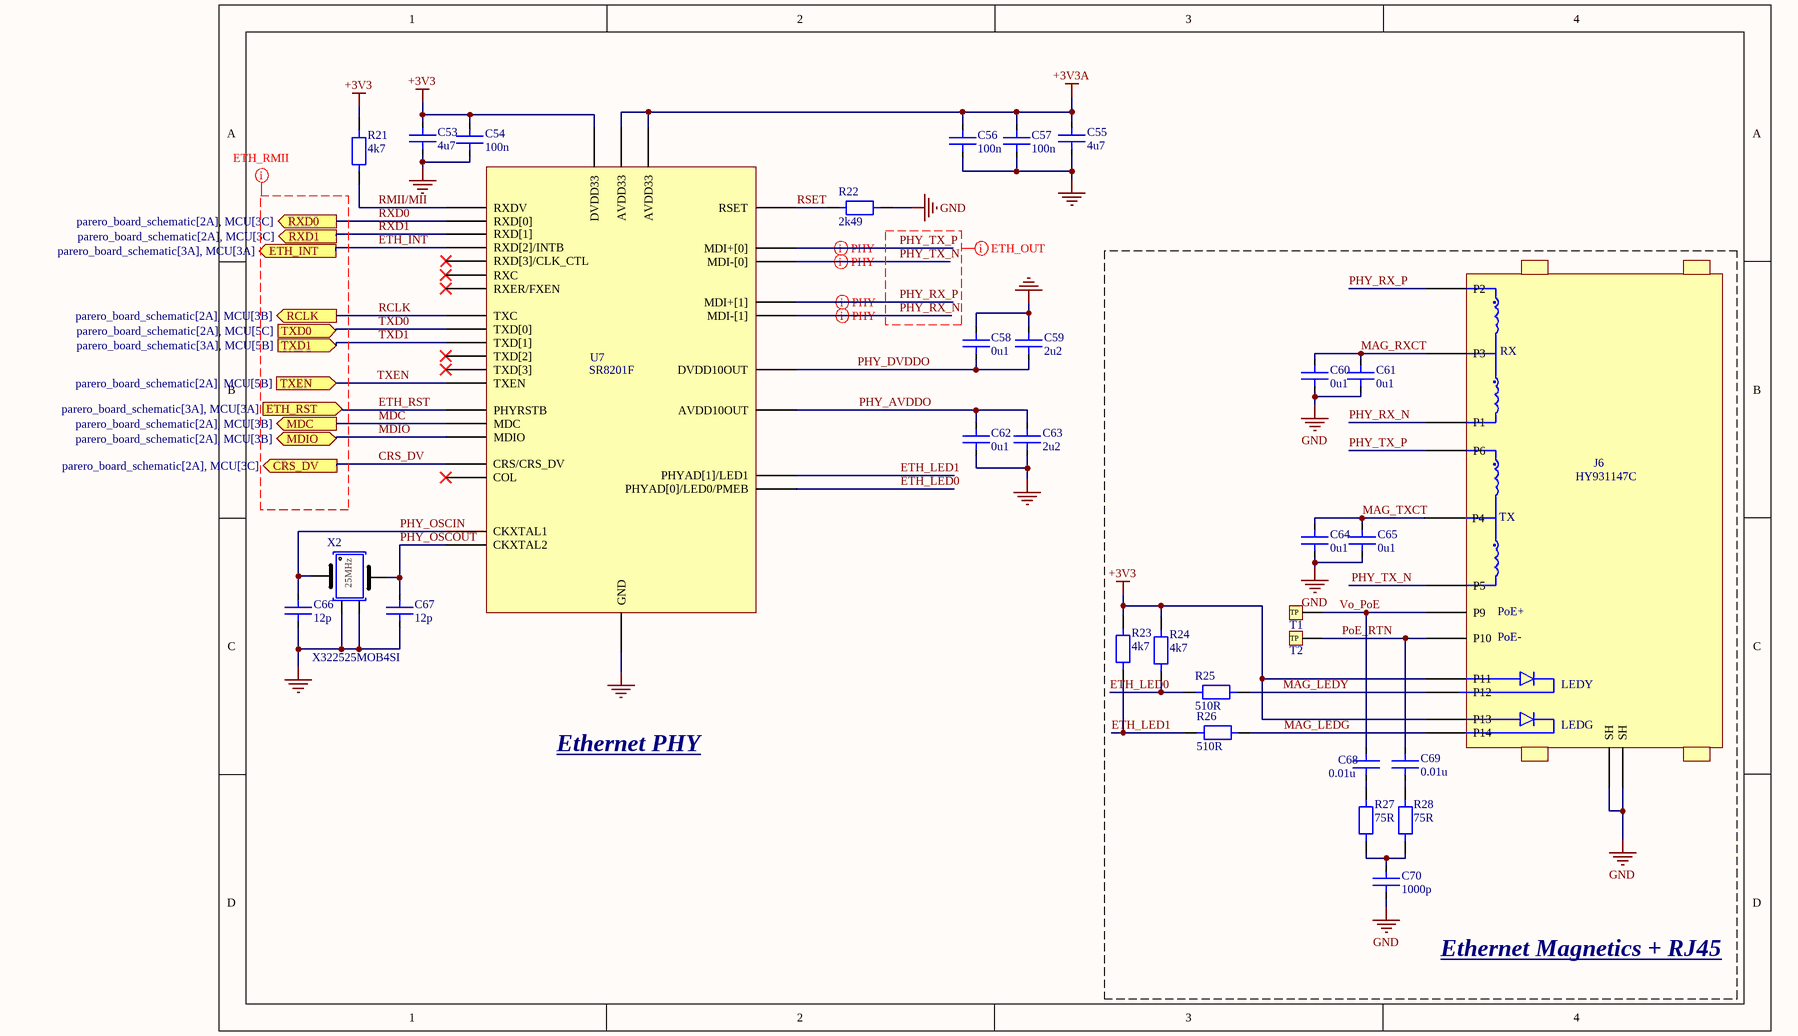
[diagram p4: Ethernet.SchDoc]

### Parts
C53  4u7  [CAP_MLCC_0603]
C54  100n  [CAP_MLCC_0402]
C55  4u7  [CAP_MLCC_0603]
C56  100n  [CAP_MLCC_0402]
C57  100n  [CAP_MLCC_0402]
C58  0u1  [CAP_MLCC_0402]
C59  2u2  [CAP_MLCC_0402]
C60  0u1  [CAP_MLCC_0402]
C61  0u1  [CAP_MLCC_0402]
C62  0u1  [CAP_MLCC_0402]
C63  2u2  [CAP_MLCC_0402]
C64  0u1  [CAP_MLCC_0402]
C65  0u1  [CAP_MLCC_0402]
C66  12p  [CAP_MLCC_0402]
C67  12p  [CAP_MLCC_0402]
C68  0.01u  [CAP_MLCC_0402]
C69  0.01u  [CAP_MLCC_0402]
C70  1000p  [CAP_MLCC_0402]
J6  HY931147C  [CONN_ETH_RJ45]
R21  4k7  [RES_SMD_0402]
R22  2k49  [RES_SMD_0402]
R23  4k7  [RES_SMD_0402]
R24  4k7  [RES_SMD_0402]
R25  510R  [RES_SMD_0402]
R26  510R  [RES_SMD_0402]
R27  75R  [RES_SMD_0402]
R28  75R  [RES_SMD_0402]
T1  TP  [TPAD]  (value not drawn)  (no BOM)
T2  TP  [TPAD]  (value not drawn)  (no BOM)
U7  SR8201F  [SR8201F_QFN32]
X2  X322525MOB4SI  [XTAL_SMD_YXC]

### Blocks framed on the sheet
Ethernet Magnetics + RJ45: C60 C61 C64 C65 C68-C70 J6 R23-R28 T1 T2

### Ports
CRS_DV (out, see parero_board_schematic[2A], MCU[3C]), ETH_INT (out, see parero_board_schematic[3A], MCU[3A]), ETH_RST (in, see parero_board_schematic[3A], MCU[3A]), MDC (out, see parero_board_schematic[2A], MCU[3B]), MDIO (bidir, see parero_board_schematic[2A], MCU[3B]), RCLK (out, see parero_board_schematic[2A], MCU[3B]), RXD0 (out, see parero_board_schematic[2A], MCU[3C]), RXD1 (out, see parero_board_schematic[2A], MCU[3C]), TXD0 (in, see parero_board_schematic[2A], MCU[5C]), TXD1 (in, see parero_board_schematic[3A], MCU[5B]), TXEN (in, see parero_board_schematic[2A], MCU[5B])

### Nets
+3V3: C53.2 C54.2 J6.11(P11) J6.13(P13) R21.2 R23.2 R24.2 U7.14(DVDD33)
+3V3A: C55.2 C56.2 C57.2 U7.7(AVDD33) U7.30(AVDD33)
GND: C53.1 C54.1 C55.1 C56.1 C57.1 C58.2 C59.2 C60.1 C61.1 C62.1 C63.1 C64.1 C65.1 C66.1 C67.1 C70.1 J6.15(SH) J6.16(SH) R22.2 U7.33(GND) X2.2 X2.4
CRS_DV: U7.26(CRS/CRS_DV) ; port CRS_DV
ETH_INT: U7.11(RXD[2]/INTB) ; port ETH_INT
ETH_LED0: R24.1 R25.1 U7.24(PHYAD[0]/LED0/PMEB)
ETH_LED1: R23.1 R26.1 U7.25(PHYAD[1]/LED1)
ETH_RST: U7.21(PHYRSTB) ; port ETH_RST
MAG_LEDG: J6.14(P14) R26.2
MAG_LEDY: J6.12(P12) R25.2
MAG_RXCT: C60.2 C61.2 J6.3(P3)
MAG_TXCT: C64.2 C65.2 J6.4(P4)
MDC: U7.22(MDC) ; port MDC
MDIO: U7.23(MDIO) ; port MDIO
PHY_AVDDO: C62.2 C63.2 U7.2(AVDD10OUT)
PHY_DVDDO: C58.1 C59.1 U7.29(DVDD10OUT)
PHY_OSCIN: C66.2 U7.31(CKXTAL1) X2.1
PHY_OSCOUT: C67.2 U7.32(CKXTAL2) X2.3
PHY_RX_N: J6.1(P1) U7.6(MDI-[1])
PHY_RX_P: J6.2(P2) U7.5(MDI+[1])
PHY_TX_N: J6.5(P5) U7.4(MDI-[0])
PHY_TX_P: J6.6(P6) U7.3(MDI+[0])
PoE_RTN: C69.2 J6.10(P10) T2.1(TP)
RCLK: U7.15(TXC) ; port RCLK
RMII/MII: R21.1 U7.8(RXDV)
RSET: R22.1 U7.1(RSET)
RXD0: U7.9(RXD[0]) ; port RXD0
RXD1: U7.10(RXD[1]) ; port RXD1
TXD0: U7.16(TXD[0]) ; port TXD0
TXD1: U7.17(TXD[1]) ; port TXD1
TXEN: U7.20(TXEN) ; port TXEN
Vo_PoE: C68.2 J6.9(P9) T1.1(TP)
NetC68_1: C68.1 R27.2
NetC69_1: C69.1 R28.2
NetC70_2: C70.2 R27.1 R28.1

Not connected (* = marked no-connect by the designer): U7 12(RXD[3]/CLK_CTL)* 13(RXC)* 18(TXD[2])* 19(TXD[3])* 27(COL)* 28(RXER/FXEN)*

### Layout directives
net class ETH_RMII: (no net found under the mark)
net class ETH_OUT: PHY_RX_N, PHY_RX_P, PHY_TX_N, PHY_TX_P
differential pair: PHY_RX_N, PHY_RX_P, PHY_TX_N, PHY_TX_P

### Notes on the sheet
- Ethernet PHY
- (in symbol Connector RJ45 MagJack) RX; TX; PoE+; PoE-; LEDY; LEDG
- (in symbol Crystal SMD 25MHz) 25MHz

### Library data of the parts
C53 C55 = Cap MLCC 0603: as C9 on sheet MCU; Quantity: *
C54 C56-C58 C60-C62 C64 C65 = Cap MLCC 0402: as C1 on sheet parero_board_schematic; Quantity: *
C59 C63 = Cap MLCC 0402: as C24 on sheet MCU; Quantity: *
C66 C67 = Cap MLCC 0402: as C34 on sheet MCU; Quantity: *
C68 C69 = Cap MLCC 0402: as C8 on sheet parero_board_schematic; Quantity: *
C70 = Cap MLCC 0402: Multilayer  Ceramic Capacitor; Manufacturer 1: muRata; Manufacturer Part Number 1: GRM1555C1H102JA01D; Designator: C?; Quantity: *
J6 = Connector RJ45 MagJack: 1 With LED Through Hole Modular/Ethernet Connector Jacks With Magnetics RoHS; Manufacturer 1: HANRUN(Zhongshan HanRun Elec); Designator: J?; Manufacturer Part Number 1: HY931147C; Quantity: *; ComponentLink1Description: Product Link; ComponentLink1URL: https://www.lcsc.com/product-detail/C91754.html; ComponentLink2Description: Datasheet; ComponentLink2URL: https://item.szlcsc.com/datasheet/HY931147C/92943.html
R21 R23 R24 = Resistor 0402: as R6 on sheet MCU; Quantity: *
R22 = Resistor 0402: General Purpose SMD Carbon Resistor; Manufacturer 1: UNI-ROYAL; Manufacturer Part Number 1: 0402WGF2491TCE; Quantity: *
R25 R26 = Resistor 0402: General Purpose SMD Carbon Resistor; Manufacturer 1: UNI-ROYAL; Manufacturer Part Number 1: 0402WGF5100TCE; Quantity: *
R27 R28 = Resistor 0402: General Purpose SMD Carbon Resistor; Manufacturer 1: UNI-ROYAL; Manufacturer Part Number 1: 0402WGF750JTCE; Designator: R?; Quantity: *
T1 T2 = Tpad: Test Pad
U7 = Interface ETHERNET PHY SR8201F: Single-chip 10/100M Ethernet PHYceiver, supporting Auto MDIX; Manufacturer 1: CoreChips; Designator: U?; Manufacturer Part Number 1: SR8201F; Quantity: *; ComponentLink1Description: Product Link; ComponentLink1URL: https://www.lcsc.com/product-detail/C378491.html; ComponentLink2Description: Datasheet; ComponentLink2URL: https://item.szlcsc.com/datasheet/SR8201F/351626.html
X2 = Crystal SMD 25MHz: Crystal Oscillator 12pF SMD3225-4P Crystals ROHS; Manufacturer 1: YXC Crystal Oscillators; Designator: X?; Manufacturer Part Number 1: X322525MOB4SI; Quantity: *; ComponentLink1Description: Datasheet; ComponentLink1URL: https://item.szlcsc.com/datasheet/X322525MOB4SI/9526.html?lcsc_vid=T1EMVlBfE1BXVVADFQQNUlMFT1RXUAZeFlhfBlAAQVExVlNQR1lZUlNfQVJeUTsOAxUeFF5JWBEcCEoDFhIXAgAHWQIBCks%3D; ComponentLink2Description: Product Link; ComponentLink2URL: https://www.lcsc.com/product-detail/C9006.html

## Nets that join several sheets
+3V3: parero_board_schematic (6 pins), MCU (62 pins), Peripherals (15 pins), Ethernet (8 pins)
+3V3A: parero_board_schematic (C7.2 D1.2 FB1.1 R2.2), MCU (6 pins), Ethernet (5 pins)
GND: parero_board_schematic (18 pins), MCU (79 pins), Peripherals (18 pins), Ethernet (22 pins)
VBUS: parero_board_schematic (6 pins), MCU (R10.2)
CLK: MCU (U3.141), Peripherals (J5.5)
CMD: MCU (U3.144), Peripherals (J5.3 R20.1)
CRS_DV: MCU (U3.53), Ethernet (U7.26)
DAT0: MCU (U3.117), Peripherals (J5.7 R16.1)
DAT1: MCU (U3.118), Peripherals (J5.8 R17.1)
DAT2: MCU (U3.139), Peripherals (J5.1 R18.1)
DAT3: MCU (U3.140), Peripherals (J5.2 R19.1)
ETH_INT: MCU (U3.1), Ethernet (U7.11)
ETH_RST: MCU (U3.2), Ethernet (U7.21)
MDC: MCU (U3.33), Ethernet (U7.22)
MDIO: MCU (U3.42), Ethernet (U7.23)
MPU_SCL: MCU (U3.164), Peripherals (R15.1 U6.23)
MPU_SDA: MCU (U3.165), Peripherals (R14.1 U6.24)
NetR13_1: MCU (U3.173), Peripherals (R13.1 U6.12)
RCLK: MCU (U3.41), Ethernet (U7.15)
RXD0: MCU (U3.54), Ethernet (U7.9)
RXD1: MCU (U3.55), Ethernet (U7.10)
TXD0: MCU (U3.92), Ethernet (U7.16)
TXD1: MCU (U3.157), Ethernet (U7.17)
TXEN: MCU (U3.154), Ethernet (U7.20)
USB_D_N: parero_board_schematic (J1.5 J1.7), MCU (U3.122)
USB_D_P: parero_board_schematic (J1.6 J1.8), MCU (U3.123)